# Altium project PCB_Project_1.PrjPcb
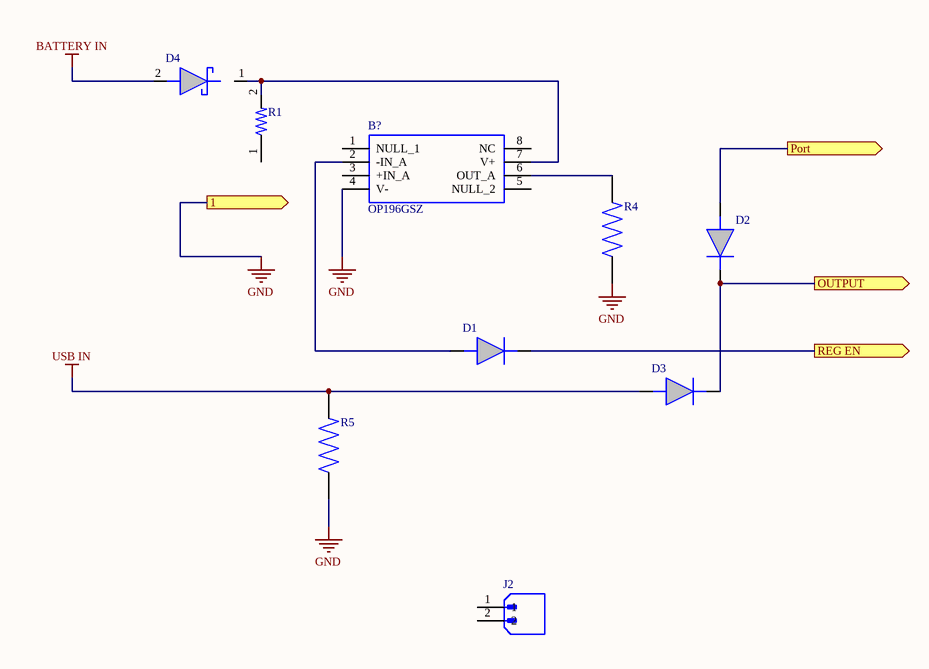
[diagram p0: Sheet1.SchDoc]
1 sheet, 9 parts. Net scope: flat (ports and power ports of the same name join across sheets).
Board file: PCB1.PcbDoc

## Sheet Sheet1.SchDoc
size A

### Parts
B?  OP196GSZ  [SOIC127P600X175-8N]
D1  (no value)  [SOD2513X110N]
D2  (no value)  [SOD2513X110N]
D3  (no value)  [SOD2513X110N]
D4  (no value)  [SODFL3516X108N]
J2  (no value)  [MOLEX_22-29-2021]
R1  (no value)  [RESC2012X60]
R4  (no value)  [RESC5024X64N]
R5  (no value)  [RESC5024X64N]

### Ports
1, OUTPUT, Port, REG EN

### Nets
BATTERY IN: D4.2(A)
GND: B?.4(V-) R4.1 R5.1 ; port 1
USB IN: D3.2(A) R5.2
NetB?_2: B?.2(-IN_A) D1.2(A)
NetB?_6: B?.6(OUT_A) R4.2
NetB?_7: B?.7(V+) D4.1(K) R1.2
NetD1_1: D1.1(K) ; port REG EN
NetD2_1: D2.1(K) D3.1(K) ; port OUTPUT
NetD2_2: D2.2(A) ; port Port

Not connected (* = marked no-connect by the designer): B? 1(NULL_1) 3(+IN_A) 5(NULL_2) 8(NC); J2 1 2; R1 1

### Library data of the parts
B? = OP196GSZ: OP Amp Single GP R-R I/O 12V 8-Pin SOIC; Manufacturer_Name: Analog Devices; Geometry.Height: 1.75mm; Mouser Part Number: 584-OP196GSZ; Mouser Price/Stock: https://www.mouser.co.uk/ProductDetail/Analog-Devices/OP196GSZ?qs=WIvQP4zGanhHnffQ5RNB3Q%3D%3D; Manufacturer_Part_Number: OP196GSZ; Datasheet Link: http://www.analog.com/media/en/technical-documentation/data-sheets/OP196_296_496.pdf
D1-D3 = BAT_60B_E6327: Schottky Diodes & Rectifiers Silicon Schottky Diode; Manufacturer_Name: Infineon; Manufacturer_Part_Number: BAT 60B E6327; Geometry.Height: 1.1mm; Mouser Part Number: 726-BAT60BE6327; Mouser Price/Stock: https://www.mouser.co.uk/ProductDetail/Infineon-Technologies/BAT-60B-E6327?qs=mzcOS1kGbgdKRNElyBqymA%3D%3D; Datasheet Link: *
D4 = CRS08_TE85L_Q_M_: Schottky Rectifier 30V 1.5A 0.36V S-FLAT; Manufacturer_Name: Toshiba; Manufacturer_Part_Number: CRS08(TE85L,Q,M); Geometry.Height: 1.08mm; Mouser Part Number: 757-CRS08TE85LQM; Mouser Price/Stock: https://www.mouser.co.uk/ProductDetail/Toshiba/CRS08TE85LQM?qs=QPpnwDeMAqO1s3wGsfmeWQ%3D%3D; Datasheet Link: https://datasheet.datasheetarchive.com/originals/distributors/Datasheets-DGA23/1390038.pdf
J2 = 22-29-2021: Connector Header Through Hole 2 position 0.100" (2.54mm); Availability: Unavailable; Package: None; MP: 22-29-2021; Value: *; Price: None
R1 = Y16291K00000T9R: 1 kOhms Â±0.01% 0.1W, 1/10W Chip Resistor 0805 (2012 Metric) Anti-Sulfur, Moisture Resistant, Non-Inductive Metal Foil; MF: Vishay Foil; Check_prices: https://www.snapeda.com/parts/Y16291K00000T9R/Vishay+Foil+Resistors+%2528Division+of+Vishay+Precision+Group%2529/view-part/?ref=eda; Value: *; Purchase-URL: https://pricing.snapeda.com/search/part/Y16291K00000T9R/?ref=eda; SnapEDA_Link: https://www.snapeda.com/parts/Y16291K00000T9R/Vishay+Foil+Resistors+%2528Division+of+Vishay+Precision+Group%2529/view-part/?ref=snap; MP: Y16291K00000T9R; Digi-Key_Part_Number: Y1629-1.0KATR-ND; Package: 0805 Vishay
R4 R5 = Y1627100K000T9R: 100 kOhms Â±0.01% 0.5W, 1/2W Chip Resistor 2010 (5025 Metric) Moisture Resistant, Non-Inductive Metal Foil; MF: Vishay; Digi-Key_Part_Number: Y1627-100KTR-ND; SnapEDA_Link: https://www.snapeda.com/parts/Y1627100K000T9R/Vishay/view-part/?ref=snap; Check_prices: https://www.snapeda.com/parts/Y1627100K000T9R/Vishay/view-part/?ref=eda; Package: 5024 Vishay; MP: Y1627100K000T9R; Value: *; Purchase-URL: https://pricing.snapeda.com/search/part/Y1627100K000T9R/?ref=eda